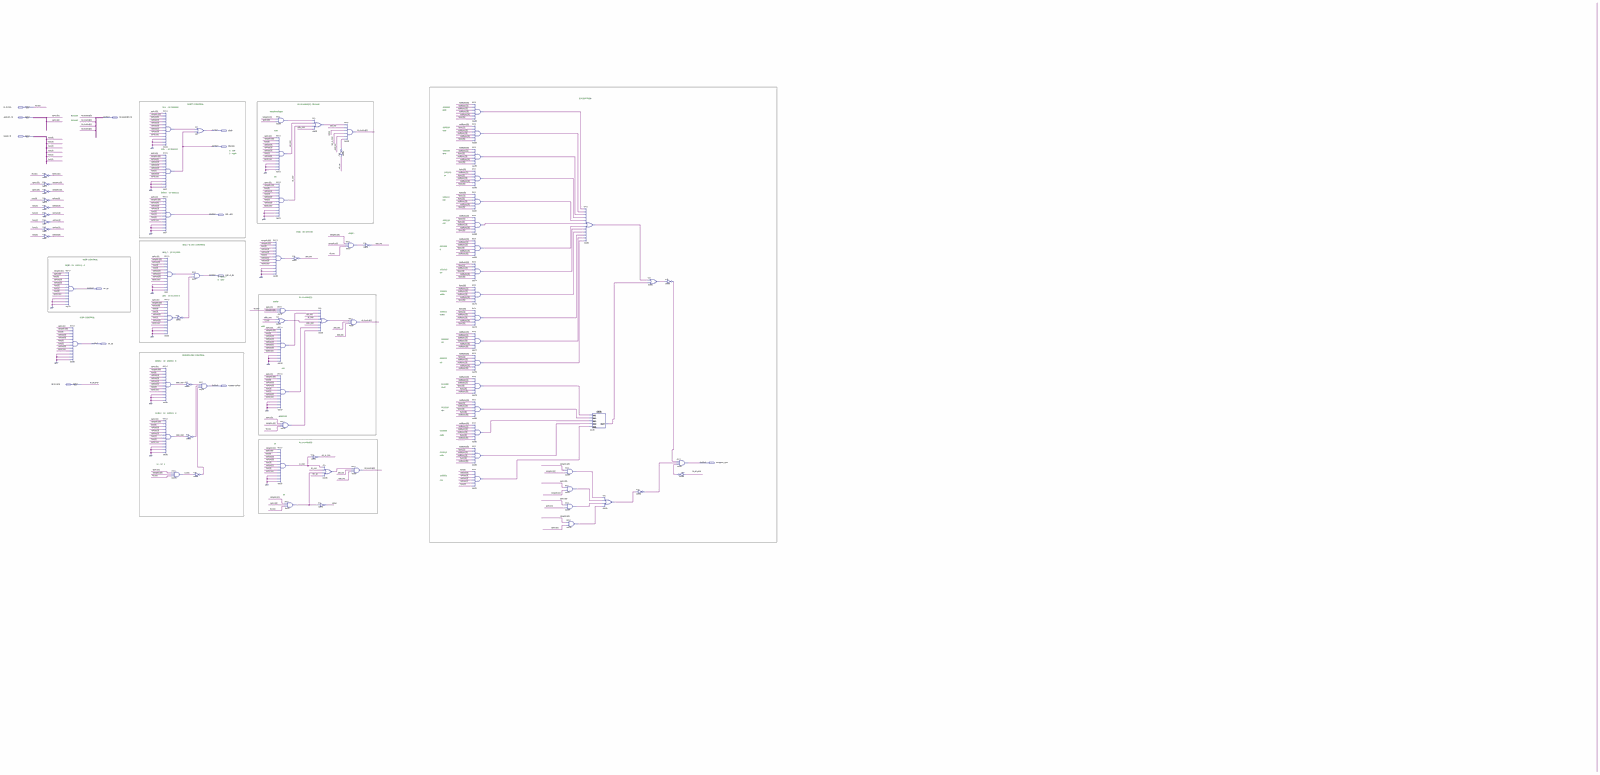
[diagram p0: schematic sheet, whole]
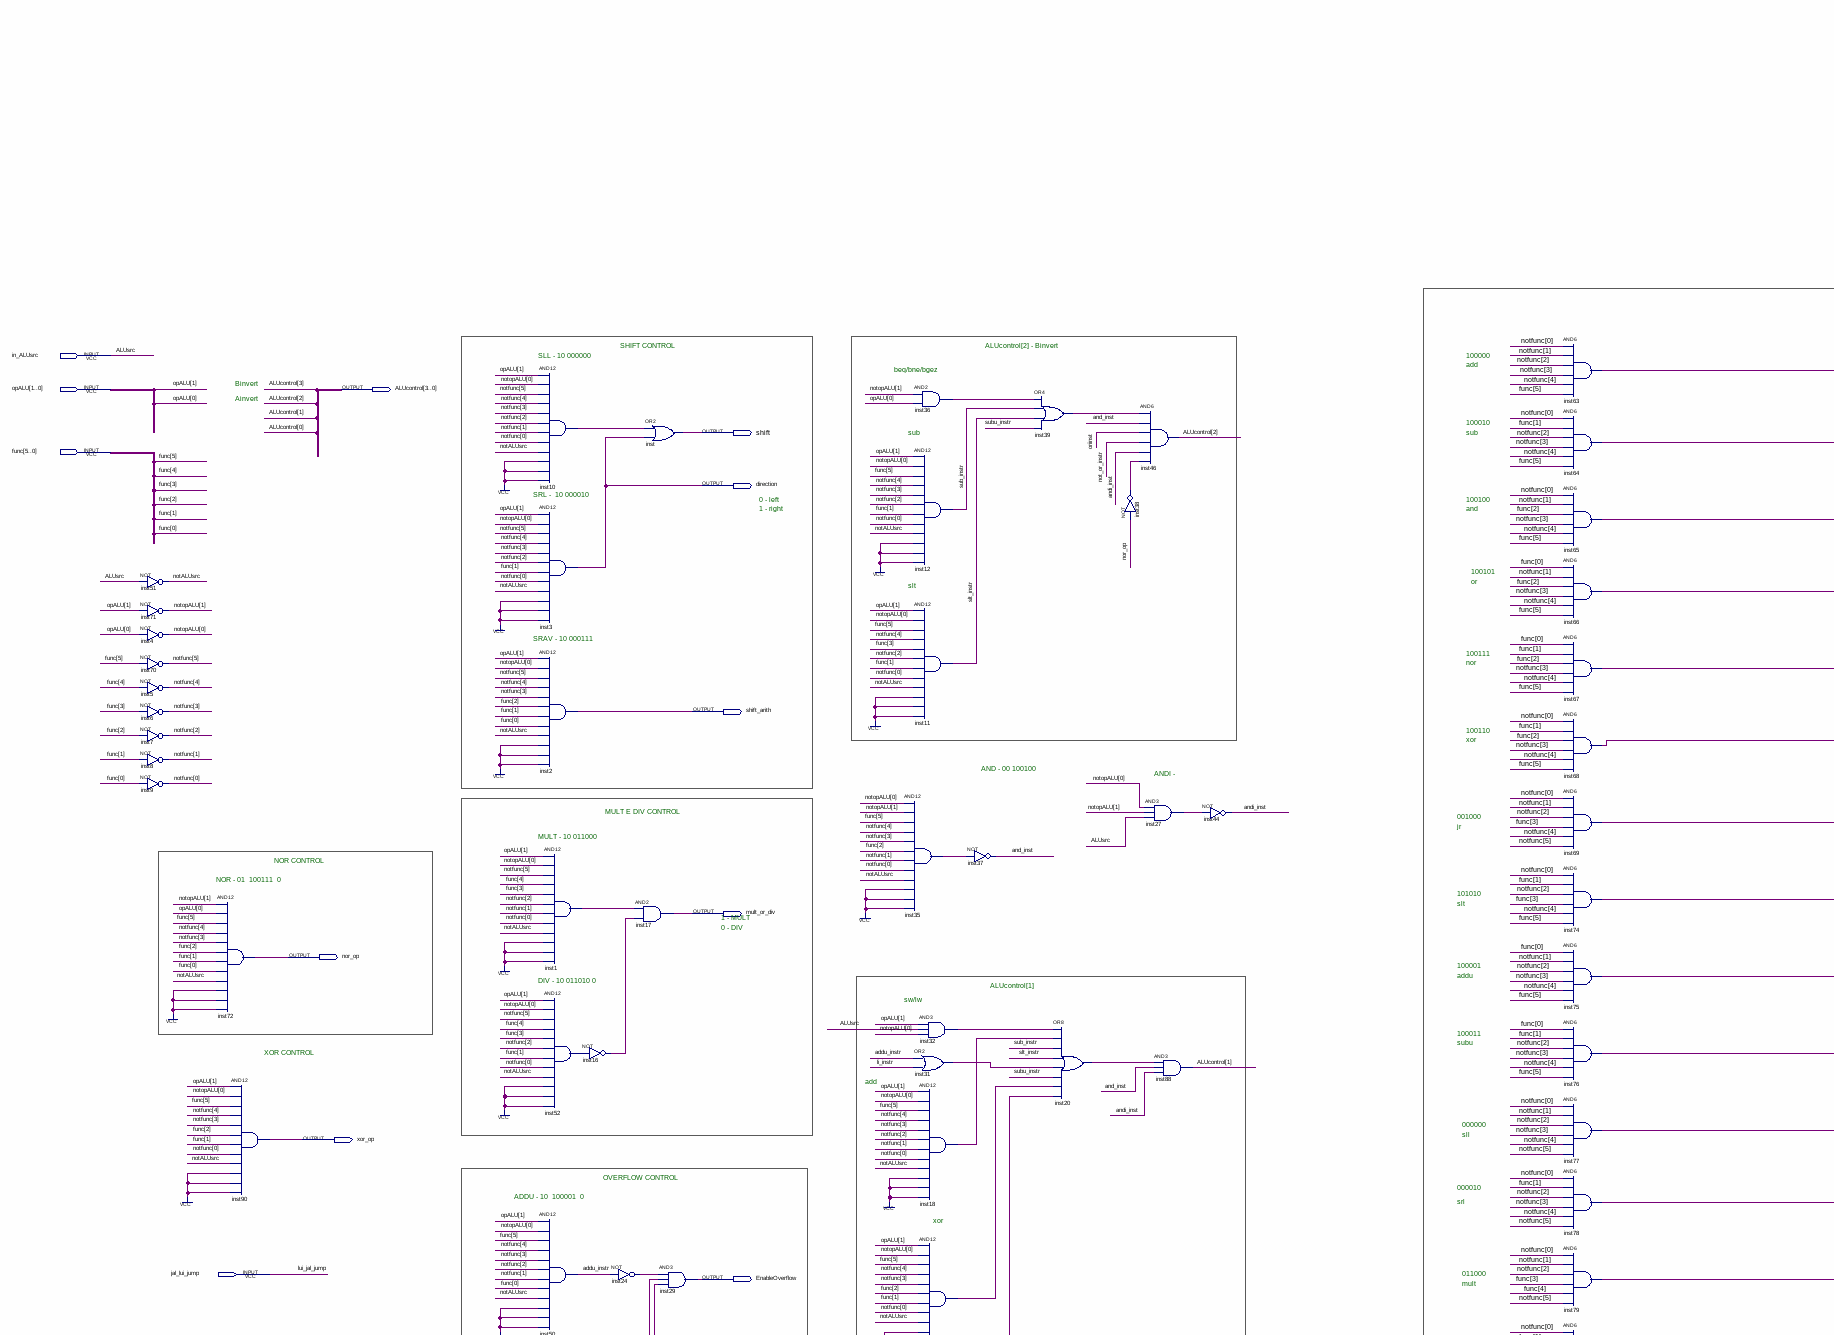
[diagram p1: schematic sheet, upper left part]
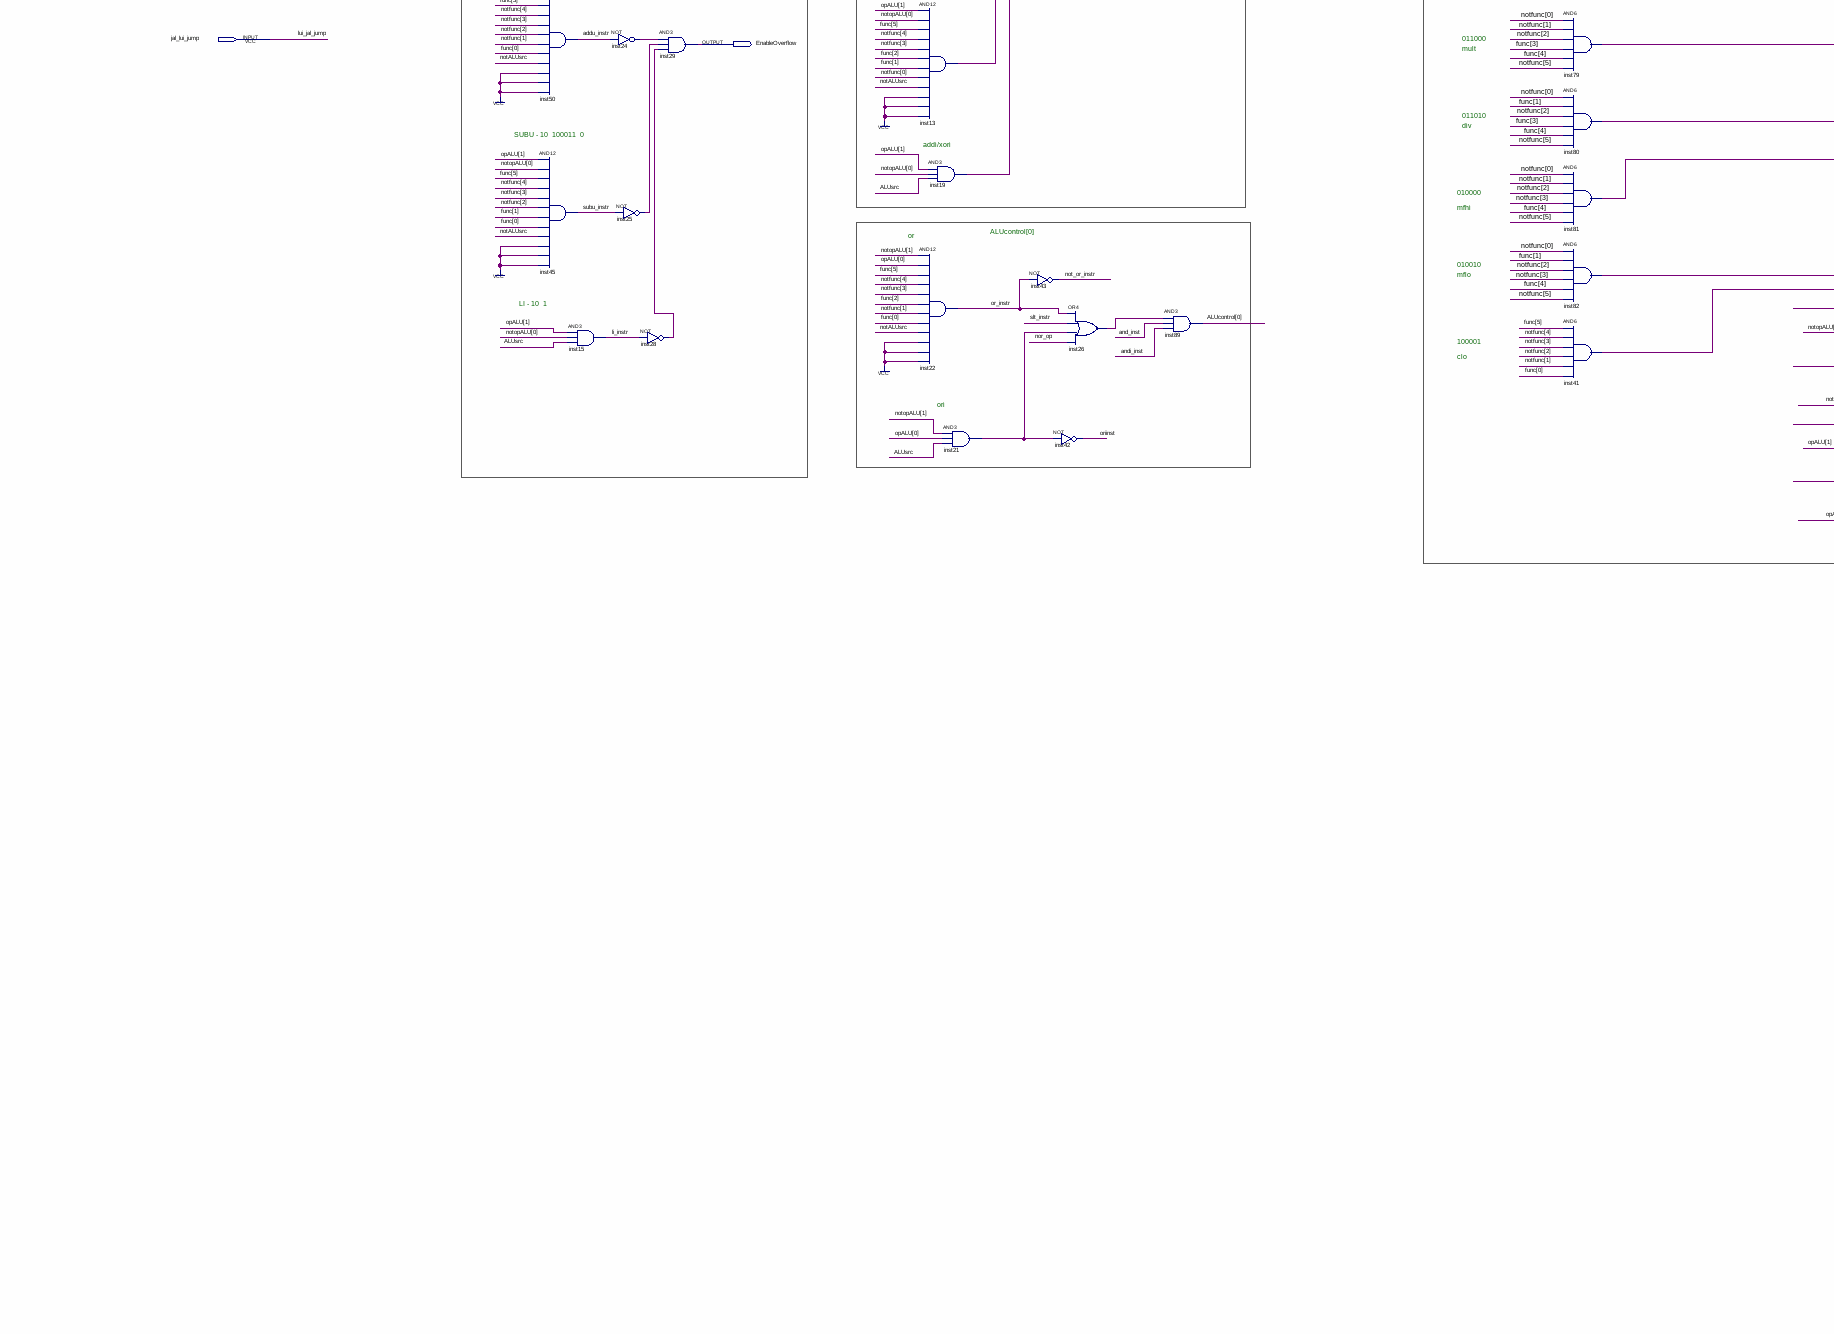
[diagram p2: schematic sheet, lower left part]
// Quartus schematic control_ula.bdf as structural Verilog: 78 symbols, 13 pins
module control_ula (
  input  in_ALUsrc,
  input  [1:0] opALU,
  input  [5:0] func,
  input  jal_lui_jump,
  output [3:0] ALUcontrol,
  output shift,
  output direction,
  output shift_arith,
  output mult_or_div,
  output nor_op,
  output xor_op,
  output EnableOverflow,
  output exception_funct
);

  wire addu_instr, and_inst, andi_inst, inst1_out, inst10_out, inst13_out, inst14_out, inst16_out,
       inst18_out, inst19_out, inst20_out, inst21_out, inst23_out, inst24_out, inst25_out, inst26_out,
       inst27_out, inst28_out, inst30_out, inst31_out, inst32_out, inst33_out, inst34_out, inst35_out,
       inst36_out, inst38_out, inst39_out, inst40_out, inst41_out, inst52_out, inst63_out, inst64_out,
       inst65_out, inst66_out, inst67_out, inst68_out, inst69_out, inst74_out, inst75_out, inst76_out,
       inst77_out, inst78_out, inst79_out, inst80_out, inst81_out, inst82_out, inst83_out, inst85_out,
       inst86_out, inst93_out, inst94_out, li_instr, not_or_instr, notALUsrc, or_instr, oriinst, slt_instr,
       sub_instr, subu_instr;
  wire [1:0] notopALU;
  wire [5:0] notfunc;

  not inst51 (notALUsrc, in_ALUsrc);
  not inst71 (notopALU[1], opALU[1]);
  not inst4 (notopALU[0], opALU[0]);
  not inst70 (notfunc[5], func[5]);
  not inst5 (notfunc[4], func[4]);
  not inst6 (notfunc[3], func[3]);
  not inst7 (notfunc[2], func[2]);
  not inst8 (notfunc[1], func[1]);
  not inst9 (notfunc[0], func[0]);
  and inst72 (nor_op, notopALU[1], opALU[0], func[5], notfunc[4], notfunc[3], func[2], func[1], func[0], notALUsrc, 1'b1, 1'b1, 1'b1);
  and inst90 (xor_op, opALU[1], notopALU[0], func[5], notfunc[4], notfunc[3], func[2], func[1], notfunc[0], notALUsrc, 1'b1, 1'b1, 1'b1);
  and inst10 (inst10_out, opALU[1], notopALU[0], notfunc[5], notfunc[4], notfunc[3], notfunc[2], notfunc[1], notfunc[0], notALUsrc, 1'b1, 1'b1, 1'b1);
  and inst3 (direction, opALU[1], notopALU[0], notfunc[5], notfunc[4], notfunc[3], notfunc[2], func[1], notfunc[0], notALUsrc, 1'b1, 1'b1, 1'b1);
  and inst2 (shift_arith, opALU[1], notopALU[0], notfunc[5], notfunc[4], notfunc[3], func[2], func[1], func[0], notALUsrc, 1'b1, 1'b1, 1'b1);
  and inst1 (inst1_out, opALU[1], notopALU[0], notfunc[5], func[4], func[3], notfunc[2], notfunc[1], notfunc[0], notALUsrc, 1'b1, 1'b1, 1'b1);
  and inst52 (inst52_out, opALU[1], notopALU[0], notfunc[5], func[4], func[3], notfunc[2], func[1], notfunc[0], notALUsrc, 1'b1, 1'b1, 1'b1);
  and inst50 (addu_instr, opALU[1], notopALU[0], func[5], notfunc[4], notfunc[3], notfunc[2], notfunc[1], func[0], notALUsrc, 1'b1, 1'b1, 1'b1);
  and inst45 (subu_instr, opALU[1], notopALU[0], func[5], notfunc[4], notfunc[3], notfunc[2], func[1], func[0], notALUsrc, 1'b1, 1'b1, 1'b1);
  not inst16 (inst16_out, inst52_out);
  and inst15 (li_instr, opALU[1], notopALU[0], in_ALUsrc);
  and inst17 (mult_or_div, inst1_out, inst16_out);
  not inst24 (inst24_out, addu_instr);
  not inst25 (inst25_out, subu_instr);
  not inst28 (inst28_out, li_instr);
  or inst (shift, inst10_out, direction);
  and inst29 (EnableOverflow, inst24_out, inst25_out, inst28_out);
  and inst35 (inst35_out, notopALU[0], notopALU[1], func[5], notfunc[4], notfunc[3], func[2], notfunc[1], notfunc[0], notALUsrc, 1'b1, 1'b1, 1'b1);
  and inst36 (inst36_out, notopALU[1], opALU[0]);
  and inst12 (sub_instr, opALU[1], notopALU[0], func[5], notfunc[4], notfunc[3], notfunc[2], func[1], notfunc[0], notALUsrc, 1'b1, 1'b1, 1'b1);
  and inst11 (slt_instr, opALU[1], notopALU[0], func[5], notfunc[4], func[3], notfunc[2], func[1], notfunc[0], notALUsrc, 1'b1, 1'b1, 1'b1);
  and inst32 (inst32_out, opALU[1], in_ALUsrc, notopALU[0]);
  or inst31 (inst31_out, addu_instr, li_instr);
  and inst18 (inst18_out, opALU[1], notopALU[0], func[5], notfunc[4], notfunc[3], notfunc[2], notfunc[1], notfunc[0], notALUsrc, 1'b1, 1'b1, 1'b1);
  and inst13 (inst13_out, opALU[1], notopALU[0], func[5], notfunc[4], notfunc[3], func[2], func[1], notfunc[0], notALUsrc, 1'b1, 1'b1, 1'b1);
  and inst19 (inst19_out, opALU[1], notopALU[0], in_ALUsrc);
  and inst22 (or_instr, notopALU[1], opALU[0], func[5], notfunc[4], notfunc[3], func[2], notfunc[1], func[0], notALUsrc, 1'b1, 1'b1, 1'b1);
  and inst21 (inst21_out, notopALU[1], opALU[0], in_ALUsrc);
  not inst37 (and_inst, inst35_out);
  or inst39 (inst39_out, inst36_out, sub_instr, slt_instr, subu_instr);
  or inst20 (inst20_out, inst32_out, inst18_out, sub_instr, slt_instr, inst31_out, subu_instr, inst13_out, inst19_out);
  not inst43 (not_or_instr, or_instr);
  not inst42 (oriinst, inst21_out);
  or inst26 (inst26_out, or_instr, slt_instr, inst21_out, nor_op);
  and inst46 (ALUcontrol[2], inst39_out, and_inst, oriinst, not_or_instr, andi_inst, inst38_out);
  not inst38 (inst38_out, nor_op);
  and inst27 (inst27_out, notopALU[0], notopALU[1], in_ALUsrc);
  and inst88 (ALUcontrol[1], inst20_out, and_inst, andi_inst);
  and inst89 (ALUcontrol[0], inst26_out, and_inst, andi_inst);
  not inst44 (andi_inst, inst27_out);
  and inst63 (inst63_out, notfunc[0], notfunc[1], notfunc[2], notfunc[3], notfunc[4], func[5]);
  and inst64 (inst64_out, notfunc[0], func[1], notfunc[2], notfunc[3], notfunc[4], func[5]);
  and inst65 (inst65_out, notfunc[0], notfunc[1], func[2], notfunc[3], notfunc[4], func[5]);
  and inst66 (inst66_out, func[0], notfunc[1], func[2], notfunc[3], notfunc[4], func[5]);
  and inst67 (inst67_out, func[0], func[1], func[2], notfunc[3], notfunc[4], func[5]);
  and inst68 (inst68_out, notfunc[0], func[1], func[2], notfunc[3], notfunc[4], func[5]);
  and inst69 (inst69_out, notfunc[0], notfunc[1], notfunc[2], func[3], notfunc[4], notfunc[5]);
  and inst74 (inst74_out, notfunc[0], func[1], notfunc[2], func[3], notfunc[4], func[5]);
  and inst75 (inst75_out, func[0], notfunc[1], notfunc[2], notfunc[3], notfunc[4], func[5]);
  and inst76 (inst76_out, func[0], func[1], notfunc[2], notfunc[3], notfunc[4], func[5]);
  and inst77 (inst77_out, notfunc[0], notfunc[1], notfunc[2], notfunc[3], notfunc[4], notfunc[5]);
  and inst78 (inst78_out, notfunc[0], func[1], notfunc[2], notfunc[3], notfunc[4], notfunc[5]);
  and inst79 (inst79_out, notfunc[0], notfunc[1], notfunc[2], func[3], func[4], notfunc[5]);
  and inst80 (inst80_out, notfunc[0], func[1], notfunc[2], func[3], func[4], notfunc[5]);
  and inst81 (inst81_out, notfunc[0], notfunc[1], notfunc[2], notfunc[3], func[4], notfunc[5]);
  and inst82 (inst82_out, notfunc[0], func[1], notfunc[2], notfunc[3], func[4], notfunc[5]);
  and inst41 (inst41_out, func[5], notfunc[4], notfunc[3], notfunc[2], notfunc[1], func[0]);
  and inst14 (inst14_out, notopALU[0], notopALU[1]);
  and inst23 (inst23_out, opALU[0], notopALU[1]);
  and inst30 (inst30_out, opALU[0], opALU[1]);
  and inst33 (inst33_out, notopALU[0], opALU[1]);
  or inst83 (inst83_out, inst63_out, inst64_out, inst65_out, inst66_out, inst67_out, inst68_out, inst69_out, inst74_out, inst75_out, inst76_out, inst77_out, inst78_out);
  or inst40 (inst40_out, inst79_out, inst80_out, inst81_out, inst82_out, inst41_out);
  or inst34 (inst34_out, inst14_out, inst23_out, inst30_out, inst33_out);
  not inst93 (inst93_out, inst34_out);
  or inst85 (inst85_out, inst83_out, inst40_out);
  not inst86 (inst86_out, inst85_out);
  and inst92 (exception_funct, inst86_out, inst93_out, inst94_out);
  not inst94 (inst94_out, jal_lui_jump);

  // Other names for the same wires on the sheet: ALUsrc = in_ALUsrc; lui_jal_jump = jal_lui_jump

  // Notes on the sheet:
  //   EXCEPTION
  //   SHIFT CONTROL
  //   ALUcontrol[2] - Binvert
  //   SLL - 10 000000
  //   100000
  //   add
  //   beq/bne/bgez
  //   Binvert
  //   Ainvert
  //   100010
  //   sub
  //   sub
  //   SRL -  10 000010
  //   0 - left
  //   100100
  //   1 - right
  //   and
  //   100101
  //   or
  //   slt
  //   SRAV - 10 000111
  //   100111
  //   nor
  //   100110
  //   xor
  //   AND - 00 100100
  //   ANDI - 
  //   MULT E DIV CONTROL
  //   001000
  //   jr
  //   MULT - 10 011000
  //   NOR CONTROL
  //   NOR - 01  100111  0
  //   101010
  //   slt
  //   1 - MULT
  //   0 - DIV
  //   100001
  //   addu
  //   DIV - 10 011010 0
  //   ALUcontrol[1]
  //   sw/lw
  //   100011
  //   subu
  //   XOR CONTROL
  //   add
  //   000000
  //   sll
  //    OVERFLOW CONTROL
  //   000010
  //   ADDU - 10  100001  0
  //   srl
  //   xor
  //   011000
  //   mult
  //   011010
  //   div
  //   SUBU - 10  100011  0
  //   addi/xori
  //   010000
  //   mfhi
  //   ALUcontrol[0]
  //   or
  //   010010
  //   mflo
  //   LI - 10  1
  //   100001
  //   clo
  //   ori
endmodule
